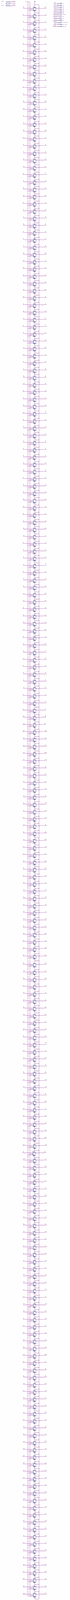
[diagram p0: schematic sheet, whole]
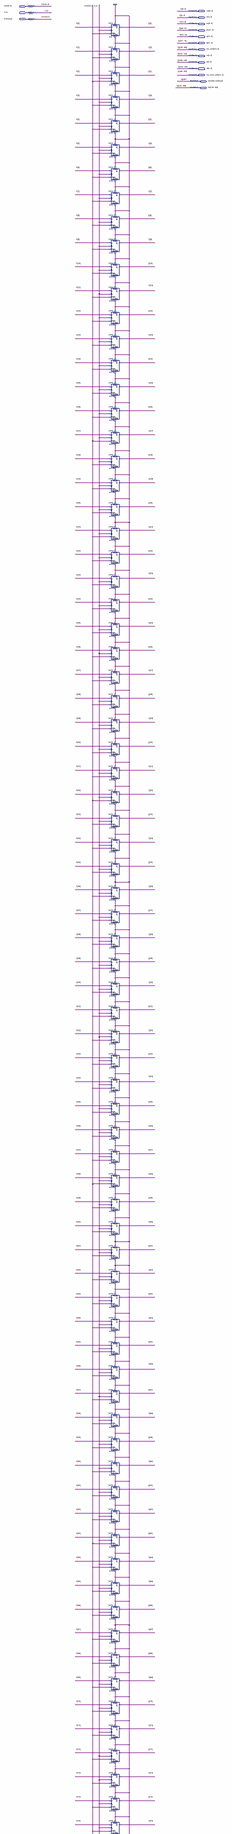
[diagram p1: schematic sheet, upper part]
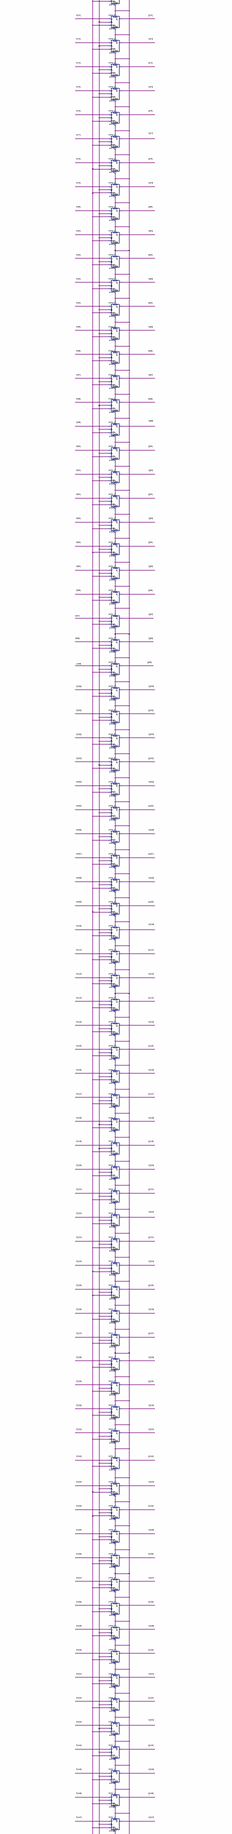
[diagram p2: schematic sheet, middle part]
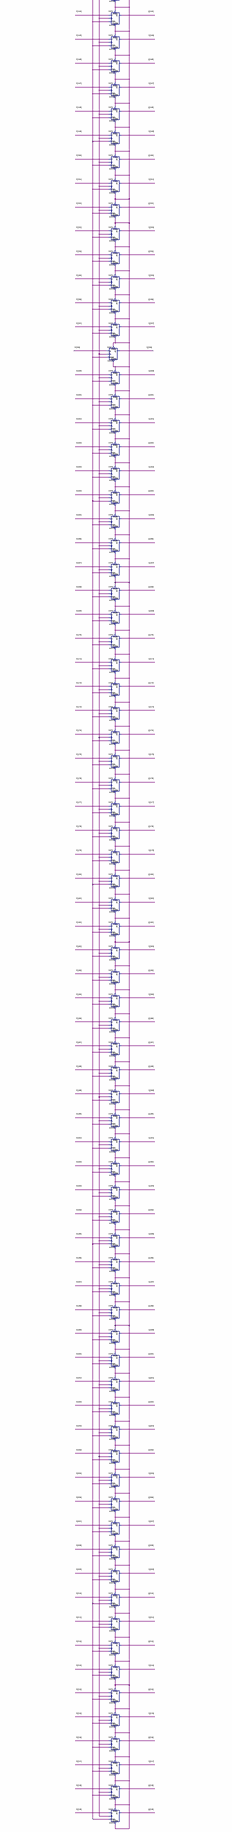
[diagram p3: schematic sheet, lower part]
// Quartus schematic REG154BIDEX.bdf as structural Verilog: 220 symbols, 16 pins
module REG154BIDEX (
  input  [219:0] D,
  input  CLK,
  input  ENABLE,
  output [2:0] wb,
  output [1:0] m,
  output [6:0] ex,
  output [31:0] pc,
  output [31:0] a,
  output [31:0] b,
  output [31:0] ext_sinal,
  output [4:0] rs,
  output [4:0] rt,
  output [4:0] rd,
  output [31:0] ext_sinal_zero,
  output escolhe_extensao,
  output [219:188] lui
);

  DFFE inst (.PRN(1'b1), .CLRN(1'b1), .D(D[0]), .CLK(CLK), .ENA(ENABLE), .Q(wb[0]));
  DFFE inst1 (.PRN(1'b1), .CLRN(1'b1), .D(D[1]), .CLK(CLK), .ENA(ENABLE), .Q(wb[1]));
  DFFE inst4 (.PRN(1'b1), .CLRN(1'b1), .D(D[2]), .CLK(CLK), .ENA(ENABLE), .Q(wb[2]));
  DFFE inst2 (.PRN(1'b1), .CLRN(1'b1), .D(D[3]), .CLK(CLK), .ENA(ENABLE), .Q(m[0]));
  DFFE inst5 (.PRN(1'b1), .CLRN(1'b1), .D(D[4]), .CLK(CLK), .ENA(ENABLE), .Q(m[1]));
  DFFE inst3 (.PRN(1'b1), .CLRN(1'b1), .D(D[5]), .CLK(CLK), .ENA(ENABLE), .Q(ex[0]));
  DFFE inst6 (.PRN(1'b1), .CLRN(1'b1), .D(D[6]), .CLK(CLK), .ENA(ENABLE), .Q(ex[1]));
  DFFE inst7 (.PRN(1'b1), .CLRN(1'b1), .D(D[7]), .CLK(CLK), .ENA(ENABLE), .Q(ex[2]));
  DFFE inst8 (.PRN(1'b1), .CLRN(1'b1), .D(D[8]), .CLK(CLK), .ENA(ENABLE), .Q(ex[3]));
  DFFE inst9 (.PRN(1'b1), .CLRN(1'b1), .D(D[9]), .CLK(CLK), .ENA(ENABLE), .Q(ex[4]));
  DFFE inst10 (.PRN(1'b1), .CLRN(1'b1), .D(D[10]), .CLK(CLK), .ENA(ENABLE), .Q(ex[5]));
  DFFE inst11 (.PRN(1'b1), .CLRN(1'b1), .D(D[11]), .CLK(CLK), .ENA(ENABLE), .Q(ex[6]));
  DFFE inst12 (.PRN(1'b1), .CLRN(1'b1), .D(D[12]), .CLK(CLK), .ENA(ENABLE), .Q(pc[0]));
  DFFE inst13 (.PRN(1'b1), .CLRN(1'b1), .D(D[13]), .CLK(CLK), .ENA(ENABLE), .Q(pc[1]));
  DFFE inst14 (.PRN(1'b1), .CLRN(1'b1), .D(D[14]), .CLK(CLK), .ENA(ENABLE), .Q(pc[2]));
  DFFE inst15 (.PRN(1'b1), .CLRN(1'b1), .D(D[15]), .CLK(CLK), .ENA(ENABLE), .Q(pc[3]));
  DFFE inst16 (.PRN(1'b1), .CLRN(1'b1), .D(D[16]), .CLK(CLK), .ENA(ENABLE), .Q(pc[4]));
  DFFE inst17 (.PRN(1'b1), .CLRN(1'b1), .D(D[17]), .CLK(CLK), .ENA(ENABLE), .Q(pc[5]));
  DFFE inst18 (.PRN(1'b1), .CLRN(1'b1), .D(D[18]), .CLK(CLK), .ENA(ENABLE), .Q(pc[6]));
  DFFE inst19 (.PRN(1'b1), .CLRN(1'b1), .D(D[19]), .CLK(CLK), .ENA(ENABLE), .Q(pc[7]));
  DFFE inst20 (.PRN(1'b1), .CLRN(1'b1), .D(D[20]), .CLK(CLK), .ENA(ENABLE), .Q(pc[8]));
  DFFE inst21 (.PRN(1'b1), .CLRN(1'b1), .D(D[21]), .CLK(CLK), .ENA(ENABLE), .Q(pc[9]));
  DFFE inst22 (.PRN(1'b1), .CLRN(1'b1), .D(D[22]), .CLK(CLK), .ENA(ENABLE), .Q(pc[10]));
  DFFE inst23 (.PRN(1'b1), .CLRN(1'b1), .D(D[23]), .CLK(CLK), .ENA(ENABLE), .Q(pc[11]));
  DFFE inst24 (.PRN(1'b1), .CLRN(1'b1), .D(D[24]), .CLK(CLK), .ENA(ENABLE), .Q(pc[12]));
  DFFE inst25 (.PRN(1'b1), .CLRN(1'b1), .D(D[25]), .CLK(CLK), .ENA(ENABLE), .Q(pc[13]));
  DFFE inst26 (.PRN(1'b1), .CLRN(1'b1), .D(D[26]), .CLK(CLK), .ENA(ENABLE), .Q(pc[14]));
  DFFE inst27 (.PRN(1'b1), .CLRN(1'b1), .D(D[27]), .CLK(CLK), .ENA(ENABLE), .Q(pc[15]));
  DFFE inst28 (.PRN(1'b1), .CLRN(1'b1), .D(D[28]), .CLK(CLK), .ENA(ENABLE), .Q(pc[16]));
  DFFE inst29 (.PRN(1'b1), .CLRN(1'b1), .D(D[29]), .CLK(CLK), .ENA(ENABLE), .Q(pc[17]));
  DFFE inst30 (.PRN(1'b1), .CLRN(1'b1), .D(D[30]), .CLK(CLK), .ENA(ENABLE), .Q(pc[18]));
  DFFE inst31 (.PRN(1'b1), .CLRN(1'b1), .D(D[31]), .CLK(CLK), .ENA(ENABLE), .Q(pc[19]));
  DFFE inst32 (.PRN(1'b1), .CLRN(1'b1), .D(D[32]), .CLK(CLK), .ENA(ENABLE), .Q(pc[20]));
  DFFE inst33 (.PRN(1'b1), .CLRN(1'b1), .D(D[33]), .CLK(CLK), .ENA(ENABLE), .Q(pc[21]));
  DFFE inst34 (.PRN(1'b1), .CLRN(1'b1), .D(D[34]), .CLK(CLK), .ENA(ENABLE), .Q(pc[22]));
  DFFE inst35 (.PRN(1'b1), .CLRN(1'b1), .D(D[35]), .CLK(CLK), .ENA(ENABLE), .Q(pc[23]));
  DFFE inst36 (.PRN(1'b1), .CLRN(1'b1), .D(D[36]), .CLK(CLK), .ENA(ENABLE), .Q(pc[24]));
  DFFE inst37 (.PRN(1'b1), .CLRN(1'b1), .D(D[37]), .CLK(CLK), .ENA(ENABLE), .Q(pc[25]));
  DFFE inst38 (.PRN(1'b1), .CLRN(1'b1), .D(D[38]), .CLK(CLK), .ENA(ENABLE), .Q(pc[26]));
  DFFE inst39 (.PRN(1'b1), .CLRN(1'b1), .D(D[39]), .CLK(CLK), .ENA(ENABLE), .Q(pc[27]));
  DFFE inst40 (.PRN(1'b1), .CLRN(1'b1), .D(D[40]), .CLK(CLK), .ENA(ENABLE), .Q(pc[28]));
  DFFE inst41 (.PRN(1'b1), .CLRN(1'b1), .D(D[41]), .CLK(CLK), .ENA(ENABLE), .Q(pc[29]));
  DFFE inst42 (.PRN(1'b1), .CLRN(1'b1), .D(D[42]), .CLK(CLK), .ENA(ENABLE), .Q(pc[30]));
  DFFE inst43 (.PRN(1'b1), .CLRN(1'b1), .D(D[43]), .CLK(CLK), .ENA(ENABLE), .Q(pc[31]));
  DFFE inst44 (.PRN(1'b1), .CLRN(1'b1), .D(D[44]), .CLK(CLK), .ENA(ENABLE), .Q(a[0]));
  DFFE inst45 (.PRN(1'b1), .CLRN(1'b1), .D(D[45]), .CLK(CLK), .ENA(ENABLE), .Q(a[1]));
  DFFE inst46 (.PRN(1'b1), .CLRN(1'b1), .D(D[46]), .CLK(CLK), .ENA(ENABLE), .Q(a[2]));
  DFFE inst47 (.PRN(1'b1), .CLRN(1'b1), .D(D[47]), .CLK(CLK), .ENA(ENABLE), .Q(a[3]));
  DFFE inst48 (.PRN(1'b1), .CLRN(1'b1), .D(D[48]), .CLK(CLK), .ENA(ENABLE), .Q(a[4]));
  DFFE inst49 (.PRN(1'b1), .CLRN(1'b1), .D(D[49]), .CLK(CLK), .ENA(ENABLE), .Q(a[5]));
  DFFE inst50 (.PRN(1'b1), .CLRN(1'b1), .D(D[50]), .CLK(CLK), .ENA(ENABLE), .Q(a[6]));
  DFFE inst51 (.PRN(1'b1), .CLRN(1'b1), .D(D[51]), .CLK(CLK), .ENA(ENABLE), .Q(a[7]));
  DFFE inst52 (.PRN(1'b1), .CLRN(1'b1), .D(D[52]), .CLK(CLK), .ENA(ENABLE), .Q(a[8]));
  DFFE inst53 (.PRN(1'b1), .CLRN(1'b1), .D(D[53]), .CLK(CLK), .ENA(ENABLE), .Q(a[9]));
  DFFE inst54 (.PRN(1'b1), .CLRN(1'b1), .D(D[54]), .CLK(CLK), .ENA(ENABLE), .Q(a[10]));
  DFFE inst55 (.PRN(1'b1), .CLRN(1'b1), .D(D[55]), .CLK(CLK), .ENA(ENABLE), .Q(a[11]));
  DFFE inst56 (.PRN(1'b1), .CLRN(1'b1), .D(D[56]), .CLK(CLK), .ENA(ENABLE), .Q(a[12]));
  DFFE inst57 (.PRN(1'b1), .CLRN(1'b1), .D(D[57]), .CLK(CLK), .ENA(ENABLE), .Q(a[13]));
  DFFE inst58 (.PRN(1'b1), .CLRN(1'b1), .D(D[58]), .CLK(CLK), .ENA(ENABLE), .Q(a[14]));
  DFFE inst59 (.PRN(1'b1), .CLRN(1'b1), .D(D[59]), .CLK(CLK), .ENA(ENABLE), .Q(a[15]));
  DFFE inst60 (.PRN(1'b1), .CLRN(1'b1), .D(D[60]), .CLK(CLK), .ENA(ENABLE), .Q(a[16]));
  DFFE inst61 (.PRN(1'b1), .CLRN(1'b1), .D(D[61]), .CLK(CLK), .ENA(ENABLE), .Q(a[17]));
  DFFE inst62 (.PRN(1'b1), .CLRN(1'b1), .D(D[62]), .CLK(CLK), .ENA(ENABLE), .Q(a[18]));
  DFFE inst63 (.PRN(1'b1), .CLRN(1'b1), .D(D[63]), .CLK(CLK), .ENA(ENABLE), .Q(a[19]));
  DFFE inst64 (.PRN(1'b1), .CLRN(1'b1), .D(D[64]), .CLK(CLK), .ENA(ENABLE), .Q(a[20]));
  DFFE inst65 (.PRN(1'b1), .CLRN(1'b1), .D(D[65]), .CLK(CLK), .ENA(ENABLE), .Q(a[21]));
  DFFE inst66 (.PRN(1'b1), .CLRN(1'b1), .D(D[66]), .CLK(CLK), .ENA(ENABLE), .Q(a[22]));
  DFFE inst67 (.PRN(1'b1), .CLRN(1'b1), .D(D[67]), .CLK(CLK), .ENA(ENABLE), .Q(a[23]));
  DFFE inst68 (.PRN(1'b1), .CLRN(1'b1), .D(D[68]), .CLK(CLK), .ENA(ENABLE), .Q(a[24]));
  DFFE inst69 (.PRN(1'b1), .CLRN(1'b1), .D(D[69]), .CLK(CLK), .ENA(ENABLE), .Q(a[25]));
  DFFE inst70 (.PRN(1'b1), .CLRN(1'b1), .D(D[70]), .CLK(CLK), .ENA(ENABLE), .Q(a[26]));
  DFFE inst71 (.PRN(1'b1), .CLRN(1'b1), .D(D[71]), .CLK(CLK), .ENA(ENABLE), .Q(a[27]));
  DFFE inst72 (.PRN(1'b1), .CLRN(1'b1), .D(D[72]), .CLK(CLK), .ENA(ENABLE), .Q(a[28]));
  DFFE inst73 (.PRN(1'b1), .CLRN(1'b1), .D(D[73]), .CLK(CLK), .ENA(ENABLE), .Q(a[29]));
  DFFE inst74 (.PRN(1'b1), .CLRN(1'b1), .D(D[74]), .CLK(CLK), .ENA(ENABLE), .Q(a[30]));
  DFFE inst75 (.PRN(1'b1), .CLRN(1'b1), .D(D[75]), .CLK(CLK), .ENA(ENABLE), .Q(a[31]));
  DFFE inst76 (.PRN(1'b1), .CLRN(1'b1), .D(D[76]), .CLK(CLK), .ENA(ENABLE), .Q(b[0]));
  DFFE inst77 (.PRN(1'b1), .CLRN(1'b1), .D(D[77]), .CLK(CLK), .ENA(ENABLE), .Q(b[1]));
  DFFE inst78 (.PRN(1'b1), .CLRN(1'b1), .D(D[78]), .CLK(CLK), .ENA(ENABLE), .Q(b[2]));
  DFFE inst79 (.PRN(1'b1), .CLRN(1'b1), .D(D[79]), .CLK(CLK), .ENA(ENABLE), .Q(b[3]));
  DFFE inst80 (.PRN(1'b1), .CLRN(1'b1), .D(D[80]), .CLK(CLK), .ENA(ENABLE), .Q(b[4]));
  DFFE inst81 (.PRN(1'b1), .CLRN(1'b1), .D(D[81]), .CLK(CLK), .ENA(ENABLE), .Q(b[5]));
  DFFE inst82 (.PRN(1'b1), .CLRN(1'b1), .D(D[82]), .CLK(CLK), .ENA(ENABLE), .Q(b[6]));
  DFFE inst83 (.PRN(1'b1), .CLRN(1'b1), .D(D[83]), .CLK(CLK), .ENA(ENABLE), .Q(b[7]));
  DFFE inst84 (.PRN(1'b1), .CLRN(1'b1), .D(D[84]), .CLK(CLK), .ENA(ENABLE), .Q(b[8]));
  DFFE inst85 (.PRN(1'b1), .CLRN(1'b1), .D(D[85]), .CLK(CLK), .ENA(ENABLE), .Q(b[9]));
  DFFE inst86 (.PRN(1'b1), .CLRN(1'b1), .D(D[86]), .CLK(CLK), .ENA(ENABLE), .Q(b[10]));
  DFFE inst87 (.PRN(1'b1), .CLRN(1'b1), .D(D[87]), .CLK(CLK), .ENA(ENABLE), .Q(b[11]));
  DFFE inst88 (.PRN(1'b1), .CLRN(1'b1), .D(D[88]), .CLK(CLK), .ENA(ENABLE), .Q(b[12]));
  DFFE inst89 (.PRN(1'b1), .CLRN(1'b1), .D(D[89]), .CLK(CLK), .ENA(ENABLE), .Q(b[13]));
  DFFE inst90 (.PRN(1'b1), .CLRN(1'b1), .D(D[90]), .CLK(CLK), .ENA(ENABLE), .Q(b[14]));
  DFFE inst91 (.PRN(1'b1), .CLRN(1'b1), .D(D[91]), .CLK(CLK), .ENA(ENABLE), .Q(b[15]));
  DFFE inst92 (.PRN(1'b1), .CLRN(1'b1), .D(D[92]), .CLK(CLK), .ENA(ENABLE), .Q(b[16]));
  DFFE inst93 (.PRN(1'b1), .CLRN(1'b1), .D(D[93]), .CLK(CLK), .ENA(ENABLE), .Q(b[17]));
  DFFE inst94 (.PRN(1'b1), .CLRN(1'b1), .D(D[94]), .CLK(CLK), .ENA(ENABLE), .Q(b[18]));
  DFFE inst95 (.PRN(1'b1), .CLRN(1'b1), .D(D[95]), .CLK(CLK), .ENA(ENABLE), .Q(b[19]));
  DFFE inst96 (.PRN(1'b1), .CLRN(1'b1), .D(D[96]), .CLK(CLK), .ENA(ENABLE), .Q(b[20]));
  DFFE inst99 (.PRN(1'b1), .CLRN(1'b1), .D(D[97]), .CLK(CLK), .ENA(ENABLE), .Q(b[21]));
  DFFE inst132 (.PRN(1'b1), .CLRN(1'b1), .D(D[98]), .CLK(CLK), .ENA(ENABLE), .Q(b[22]));
  DFFE inst133 (.PRN(1'b1), .CLRN(1'b1), .D(D[99]), .CLK(CLK), .ENA(ENABLE), .Q(b[23]));
  DFFE inst100 (.PRN(1'b1), .CLRN(1'b1), .D(D[100]), .CLK(CLK), .ENA(ENABLE), .Q(b[24]));
  DFFE inst101 (.PRN(1'b1), .CLRN(1'b1), .D(D[101]), .CLK(CLK), .ENA(ENABLE), .Q(b[25]));
  DFFE inst102 (.PRN(1'b1), .CLRN(1'b1), .D(D[102]), .CLK(CLK), .ENA(ENABLE), .Q(b[26]));
  DFFE inst103 (.PRN(1'b1), .CLRN(1'b1), .D(D[103]), .CLK(CLK), .ENA(ENABLE), .Q(b[27]));
  DFFE inst104 (.PRN(1'b1), .CLRN(1'b1), .D(D[104]), .CLK(CLK), .ENA(ENABLE), .Q(b[28]));
  DFFE inst105 (.PRN(1'b1), .CLRN(1'b1), .D(D[105]), .CLK(CLK), .ENA(ENABLE), .Q(b[29]));
  DFFE inst106 (.PRN(1'b1), .CLRN(1'b1), .D(D[106]), .CLK(CLK), .ENA(ENABLE), .Q(b[30]));
  DFFE inst107 (.PRN(1'b1), .CLRN(1'b1), .D(D[107]), .CLK(CLK), .ENA(ENABLE), .Q(b[31]));
  DFFE inst108 (.PRN(1'b1), .CLRN(1'b1), .D(D[108]), .CLK(CLK), .ENA(ENABLE), .Q(ext_sinal[0]));
  DFFE inst109 (.PRN(1'b1), .CLRN(1'b1), .D(D[109]), .CLK(CLK), .ENA(ENABLE), .Q(ext_sinal[1]));
  DFFE inst110 (.PRN(1'b1), .CLRN(1'b1), .D(D[110]), .CLK(CLK), .ENA(ENABLE), .Q(ext_sinal[2]));
  DFFE inst111 (.PRN(1'b1), .CLRN(1'b1), .D(D[111]), .CLK(CLK), .ENA(ENABLE), .Q(ext_sinal[3]));
  DFFE inst112 (.PRN(1'b1), .CLRN(1'b1), .D(D[112]), .CLK(CLK), .ENA(ENABLE), .Q(ext_sinal[4]));
  DFFE inst113 (.PRN(1'b1), .CLRN(1'b1), .D(D[113]), .CLK(CLK), .ENA(ENABLE), .Q(ext_sinal[5]));
  DFFE inst114 (.PRN(1'b1), .CLRN(1'b1), .D(D[114]), .CLK(CLK), .ENA(ENABLE), .Q(ext_sinal[6]));
  DFFE inst115 (.PRN(1'b1), .CLRN(1'b1), .D(D[115]), .CLK(CLK), .ENA(ENABLE), .Q(ext_sinal[7]));
  DFFE inst116 (.PRN(1'b1), .CLRN(1'b1), .D(D[116]), .CLK(CLK), .ENA(ENABLE), .Q(ext_sinal[8]));
  DFFE inst117 (.PRN(1'b1), .CLRN(1'b1), .D(D[117]), .CLK(CLK), .ENA(ENABLE), .Q(ext_sinal[9]));
  DFFE inst118 (.PRN(1'b1), .CLRN(1'b1), .D(D[118]), .CLK(CLK), .ENA(ENABLE), .Q(ext_sinal[10]));
  DFFE inst119 (.PRN(1'b1), .CLRN(1'b1), .D(D[119]), .CLK(CLK), .ENA(ENABLE), .Q(ext_sinal[11]));
  DFFE inst120 (.PRN(1'b1), .CLRN(1'b1), .D(D[120]), .CLK(CLK), .ENA(ENABLE), .Q(ext_sinal[12]));
  DFFE inst121 (.PRN(1'b1), .CLRN(1'b1), .D(D[121]), .CLK(CLK), .ENA(ENABLE), .Q(ext_sinal[13]));
  DFFE inst122 (.PRN(1'b1), .CLRN(1'b1), .D(D[122]), .CLK(CLK), .ENA(ENABLE), .Q(ext_sinal[14]));
  DFFE inst123 (.PRN(1'b1), .CLRN(1'b1), .D(D[123]), .CLK(CLK), .ENA(ENABLE), .Q(ext_sinal[15]));
  DFFE inst124 (.PRN(1'b1), .CLRN(1'b1), .D(D[124]), .CLK(CLK), .ENA(ENABLE), .Q(ext_sinal[16]));
  DFFE inst125 (.PRN(1'b1), .CLRN(1'b1), .D(D[125]), .CLK(CLK), .ENA(ENABLE), .Q(ext_sinal[17]));
  DFFE inst126 (.PRN(1'b1), .CLRN(1'b1), .D(D[126]), .CLK(CLK), .ENA(ENABLE), .Q(ext_sinal[18]));
  DFFE inst127 (.PRN(1'b1), .CLRN(1'b1), .D(D[127]), .CLK(CLK), .ENA(ENABLE), .Q(ext_sinal[19]));
  DFFE inst128 (.PRN(1'b1), .CLRN(1'b1), .D(D[128]), .CLK(CLK), .ENA(ENABLE), .Q(ext_sinal[20]));
  DFFE inst129 (.PRN(1'b1), .CLRN(1'b1), .D(D[129]), .CLK(CLK), .ENA(ENABLE), .Q(ext_sinal[21]));
  DFFE inst130 (.PRN(1'b1), .CLRN(1'b1), .D(D[130]), .CLK(CLK), .ENA(ENABLE), .Q(ext_sinal[22]));
  DFFE inst131 (.PRN(1'b1), .CLRN(1'b1), .D(D[131]), .CLK(CLK), .ENA(ENABLE), .Q(ext_sinal[23]));
  DFFE inst97 (.PRN(1'b1), .CLRN(1'b1), .D(D[132]), .CLK(CLK), .ENA(ENABLE), .Q(ext_sinal[24]));
  DFFE inst134 (.PRN(1'b1), .CLRN(1'b1), .D(D[133]), .CLK(CLK), .ENA(ENABLE), .Q(ext_sinal[25]));
  DFFE inst135 (.PRN(1'b1), .CLRN(1'b1), .D(D[134]), .CLK(CLK), .ENA(ENABLE), .Q(ext_sinal[26]));
  DFFE inst136 (.PRN(1'b1), .CLRN(1'b1), .D(D[135]), .CLK(CLK), .ENA(ENABLE), .Q(ext_sinal[27]));
  DFFE inst137 (.PRN(1'b1), .CLRN(1'b1), .D(D[136]), .CLK(CLK), .ENA(ENABLE), .Q(ext_sinal[28]));
  DFFE inst138 (.PRN(1'b1), .CLRN(1'b1), .D(D[137]), .CLK(CLK), .ENA(ENABLE), .Q(ext_sinal[29]));
  DFFE inst139 (.PRN(1'b1), .CLRN(1'b1), .D(D[138]), .CLK(CLK), .ENA(ENABLE), .Q(ext_sinal[30]));
  DFFE inst140 (.PRN(1'b1), .CLRN(1'b1), .D(D[139]), .CLK(CLK), .ENA(ENABLE), .Q(ext_sinal[31]));
  DFFE inst141 (.PRN(1'b1), .CLRN(1'b1), .D(D[140]), .CLK(CLK), .ENA(ENABLE), .Q(rs[0]));
  DFFE inst142 (.PRN(1'b1), .CLRN(1'b1), .D(D[141]), .CLK(CLK), .ENA(ENABLE), .Q(rs[1]));
  DFFE inst143 (.PRN(1'b1), .CLRN(1'b1), .D(D[142]), .CLK(CLK), .ENA(ENABLE), .Q(rs[2]));
  DFFE inst144 (.PRN(1'b1), .CLRN(1'b1), .D(D[143]), .CLK(CLK), .ENA(ENABLE), .Q(rs[3]));
  DFFE inst145 (.PRN(1'b1), .CLRN(1'b1), .D(D[144]), .CLK(CLK), .ENA(ENABLE), .Q(rs[4]));
  DFFE inst146 (.PRN(1'b1), .CLRN(1'b1), .D(D[145]), .CLK(CLK), .ENA(ENABLE), .Q(rt[0]));
  DFFE inst147 (.PRN(1'b1), .CLRN(1'b1), .D(D[146]), .CLK(CLK), .ENA(ENABLE), .Q(rt[1]));
  DFFE inst148 (.PRN(1'b1), .CLRN(1'b1), .D(D[147]), .CLK(CLK), .ENA(ENABLE), .Q(rt[2]));
  DFFE inst149 (.PRN(1'b1), .CLRN(1'b1), .D(D[148]), .CLK(CLK), .ENA(ENABLE), .Q(rt[3]));
  DFFE inst150 (.PRN(1'b1), .CLRN(1'b1), .D(D[149]), .CLK(CLK), .ENA(ENABLE), .Q(rt[4]));
  DFFE inst151 (.PRN(1'b1), .CLRN(1'b1), .D(D[150]), .CLK(CLK), .ENA(ENABLE), .Q(rd[0]));
  DFFE inst156 (.PRN(1'b1), .CLRN(1'b1), .D(D[151]), .CLK(CLK), .ENA(ENABLE), .Q(rd[1]));
  DFFE inst157 (.PRN(1'b1), .CLRN(1'b1), .D(D[152]), .CLK(CLK), .ENA(ENABLE), .Q(rd[2]));
  DFFE inst158 (.PRN(1'b1), .CLRN(1'b1), .D(D[153]), .CLK(CLK), .ENA(ENABLE), .Q(rd[3]));
  DFFE inst159 (.PRN(1'b1), .CLRN(1'b1), .D(D[154]), .CLK(CLK), .ENA(ENABLE), .Q(rd[4]));
  DFFE inst160 (.PRN(1'b1), .CLRN(1'b1), .D(D[155]), .CLK(CLK), .ENA(ENABLE), .Q(ext_sinal_zero[0]));
  DFFE inst161 (.PRN(1'b1), .CLRN(1'b1), .D(D[156]), .CLK(CLK), .ENA(ENABLE), .Q(ext_sinal_zero[1]));
  DFFE inst162 (.PRN(1'b1), .CLRN(1'b1), .D(D[157]), .CLK(CLK), .ENA(ENABLE), .Q(ext_sinal_zero[2]));
  DFFE inst163 (.PRN(1'b1), .CLRN(1'b1), .D(D[158]), .CLK(CLK), .ENA(ENABLE), .Q(ext_sinal_zero[3]));
  DFFE inst164 (.PRN(1'b1), .CLRN(1'b1), .D(D[159]), .CLK(CLK), .ENA(ENABLE), .Q(ext_sinal_zero[4]));
  DFFE inst165 (.PRN(1'b1), .CLRN(1'b1), .D(D[160]), .CLK(CLK), .ENA(ENABLE), .Q(ext_sinal_zero[5]));
  DFFE inst166 (.PRN(1'b1), .CLRN(1'b1), .D(D[161]), .CLK(CLK), .ENA(ENABLE), .Q(ext_sinal_zero[6]));
  DFFE inst167 (.PRN(1'b1), .CLRN(1'b1), .D(D[162]), .CLK(CLK), .ENA(ENABLE), .Q(ext_sinal_zero[7]));
  DFFE inst168 (.PRN(1'b1), .CLRN(1'b1), .D(D[163]), .CLK(CLK), .ENA(ENABLE), .Q(ext_sinal_zero[8]));
  DFFE inst169 (.PRN(1'b1), .CLRN(1'b1), .D(D[164]), .CLK(CLK), .ENA(ENABLE), .Q(ext_sinal_zero[9]));
  DFFE inst170 (.PRN(1'b1), .CLRN(1'b1), .D(D[165]), .CLK(CLK), .ENA(ENABLE), .Q(ext_sinal_zero[10]));
  DFFE inst171 (.PRN(1'b1), .CLRN(1'b1), .D(D[166]), .CLK(CLK), .ENA(ENABLE), .Q(ext_sinal_zero[11]));
  DFFE inst172 (.PRN(1'b1), .CLRN(1'b1), .D(D[167]), .CLK(CLK), .ENA(ENABLE), .Q(ext_sinal_zero[12]));
  DFFE inst173 (.PRN(1'b1), .CLRN(1'b1), .D(D[168]), .CLK(CLK), .ENA(ENABLE), .Q(ext_sinal_zero[13]));
  DFFE inst174 (.PRN(1'b1), .CLRN(1'b1), .D(D[169]), .CLK(CLK), .ENA(ENABLE), .Q(ext_sinal_zero[14]));
  DFFE inst175 (.PRN(1'b1), .CLRN(1'b1), .D(D[170]), .CLK(CLK), .ENA(ENABLE), .Q(ext_sinal_zero[15]));
  DFFE inst176 (.PRN(1'b1), .CLRN(1'b1), .D(D[171]), .CLK(CLK), .ENA(ENABLE), .Q(ext_sinal_zero[16]));
  DFFE inst177 (.PRN(1'b1), .CLRN(1'b1), .D(D[172]), .CLK(CLK), .ENA(ENABLE), .Q(ext_sinal_zero[17]));
  DFFE inst178 (.PRN(1'b1), .CLRN(1'b1), .D(D[173]), .CLK(CLK), .ENA(ENABLE), .Q(ext_sinal_zero[18]));
  DFFE inst179 (.PRN(1'b1), .CLRN(1'b1), .D(D[174]), .CLK(CLK), .ENA(ENABLE), .Q(ext_sinal_zero[19]));
  DFFE inst180 (.PRN(1'b1), .CLRN(1'b1), .D(D[175]), .CLK(CLK), .ENA(ENABLE), .Q(ext_sinal_zero[20]));
  DFFE inst181 (.PRN(1'b1), .CLRN(1'b1), .D(D[176]), .CLK(CLK), .ENA(ENABLE), .Q(ext_sinal_zero[21]));
  DFFE inst182 (.PRN(1'b1), .CLRN(1'b1), .D(D[177]), .CLK(CLK), .ENA(ENABLE), .Q(ext_sinal_zero[22]));
  DFFE inst183 (.PRN(1'b1), .CLRN(1'b1), .D(D[178]), .CLK(CLK), .ENA(ENABLE), .Q(ext_sinal_zero[23]));
  DFFE inst184 (.PRN(1'b1), .CLRN(1'b1), .D(D[179]), .CLK(CLK), .ENA(ENABLE), .Q(ext_sinal_zero[24]));
  DFFE inst185 (.PRN(1'b1), .CLRN(1'b1), .D(D[180]), .CLK(CLK), .ENA(ENABLE), .Q(ext_sinal_zero[25]));
  DFFE inst186 (.PRN(1'b1), .CLRN(1'b1), .D(D[181]), .CLK(CLK), .ENA(ENABLE), .Q(ext_sinal_zero[26]));
  DFFE inst187 (.PRN(1'b1), .CLRN(1'b1), .D(D[182]), .CLK(CLK), .ENA(ENABLE), .Q(ext_sinal_zero[27]));
  DFFE inst188 (.PRN(1'b1), .CLRN(1'b1), .D(D[183]), .CLK(CLK), .ENA(ENABLE), .Q(ext_sinal_zero[28]));
  DFFE inst189 (.PRN(1'b1), .CLRN(1'b1), .D(D[184]), .CLK(CLK), .ENA(ENABLE), .Q(ext_sinal_zero[29]));
  DFFE inst190 (.PRN(1'b1), .CLRN(1'b1), .D(D[185]), .CLK(CLK), .ENA(ENABLE), .Q(ext_sinal_zero[30]));
  DFFE inst191 (.PRN(1'b1), .CLRN(1'b1), .D(D[186]), .CLK(CLK), .ENA(ENABLE), .Q(ext_sinal_zero[31]));
  DFFE inst192 (.PRN(1'b1), .CLRN(1'b1), .D(D[187]), .CLK(CLK), .ENA(ENABLE), .Q(escolhe_extensao));
  DFFE inst193 (.PRN(1'b1), .CLRN(1'b1), .D(D[188]), .CLK(CLK), .ENA(ENABLE), .Q(lui[188]));
  DFFE inst194 (.PRN(1'b1), .CLRN(1'b1), .D(D[189]), .CLK(CLK), .ENA(ENABLE), .Q(lui[189]));
  DFFE inst195 (.PRN(1'b1), .CLRN(1'b1), .D(D[190]), .CLK(CLK), .ENA(ENABLE), .Q(lui[190]));
  DFFE inst196 (.PRN(1'b1), .CLRN(1'b1), .D(D[191]), .CLK(CLK), .ENA(ENABLE), .Q(lui[191]));
  DFFE inst197 (.PRN(1'b1), .CLRN(1'b1), .D(D[192]), .CLK(CLK), .ENA(ENABLE), .Q(lui[192]));
  DFFE inst198 (.PRN(1'b1), .CLRN(1'b1), .D(D[193]), .CLK(CLK), .ENA(ENABLE), .Q(lui[193]));
  DFFE inst199 (.PRN(1'b1), .CLRN(1'b1), .D(D[194]), .CLK(CLK), .ENA(ENABLE), .Q(lui[194]));
  DFFE inst200 (.PRN(1'b1), .CLRN(1'b1), .D(D[195]), .CLK(CLK), .ENA(ENABLE), .Q(lui[195]));
  DFFE inst201 (.PRN(1'b1), .CLRN(1'b1), .D(D[196]), .CLK(CLK), .ENA(ENABLE), .Q(lui[196]));
  DFFE inst202 (.PRN(1'b1), .CLRN(1'b1), .D(D[197]), .CLK(CLK), .ENA(ENABLE), .Q(lui[197]));
  DFFE inst203 (.PRN(1'b1), .CLRN(1'b1), .D(D[198]), .CLK(CLK), .ENA(ENABLE), .Q(lui[198]));
  DFFE inst204 (.PRN(1'b1), .CLRN(1'b1), .D(D[199]), .CLK(CLK), .ENA(ENABLE), .Q(lui[199]));
  DFFE inst205 (.PRN(1'b1), .CLRN(1'b1), .D(D[200]), .CLK(CLK), .ENA(ENABLE), .Q(lui[200]));
  DFFE inst206 (.PRN(1'b1), .CLRN(1'b1), .D(D[201]), .CLK(CLK), .ENA(ENABLE), .Q(lui[201]));
  DFFE inst207 (.PRN(1'b1), .CLRN(1'b1), .D(D[202]), .CLK(CLK), .ENA(ENABLE), .Q(lui[202]));
  DFFE inst208 (.PRN(1'b1), .CLRN(1'b1), .D(D[203]), .CLK(CLK), .ENA(ENABLE), .Q(lui[203]));
  DFFE inst209 (.PRN(1'b1), .CLRN(1'b1), .D(D[204]), .CLK(CLK), .ENA(ENABLE), .Q(lui[204]));
  DFFE inst210 (.PRN(1'b1), .CLRN(1'b1), .D(D[205]), .CLK(CLK), .ENA(ENABLE), .Q(lui[205]));
  DFFE inst211 (.PRN(1'b1), .CLRN(1'b1), .D(D[206]), .CLK(CLK), .ENA(ENABLE), .Q(lui[206]));
  DFFE inst212 (.PRN(1'b1), .CLRN(1'b1), .D(D[207]), .CLK(CLK), .ENA(ENABLE), .Q(lui[207]));
  DFFE inst213 (.PRN(1'b1), .CLRN(1'b1), .D(D[208]), .CLK(CLK), .ENA(ENABLE), .Q(lui[208]));
  DFFE inst214 (.PRN(1'b1), .CLRN(1'b1), .D(D[209]), .CLK(CLK), .ENA(ENABLE), .Q(lui[209]));
  DFFE inst215 (.PRN(1'b1), .CLRN(1'b1), .D(D[210]), .CLK(CLK), .ENA(ENABLE), .Q(lui[210]));
  DFFE inst216 (.PRN(1'b1), .CLRN(1'b1), .D(D[211]), .CLK(CLK), .ENA(ENABLE), .Q(lui[211]));
  DFFE inst217 (.PRN(1'b1), .CLRN(1'b1), .D(D[212]), .CLK(CLK), .ENA(ENABLE), .Q(lui[212]));
  DFFE inst218 (.PRN(1'b1), .CLRN(1'b1), .D(D[213]), .CLK(CLK), .ENA(ENABLE), .Q(lui[213]));
  DFFE inst219 (.PRN(1'b1), .CLRN(1'b1), .D(D[214]), .CLK(CLK), .ENA(ENABLE), .Q(lui[214]));
  DFFE inst220 (.PRN(1'b1), .CLRN(1'b1), .D(D[215]), .CLK(CLK), .ENA(ENABLE), .Q(lui[215]));
  DFFE inst221 (.PRN(1'b1), .CLRN(1'b1), .D(D[216]), .CLK(CLK), .ENA(ENABLE), .Q(lui[216]));
  DFFE inst222 (.PRN(1'b1), .CLRN(1'b1), .D(D[217]), .CLK(CLK), .ENA(ENABLE), .Q(lui[217]));
  DFFE inst223 (.PRN(1'b1), .CLRN(1'b1), .D(D[218]), .CLK(CLK), .ENA(ENABLE), .Q(lui[218]));
  DFFE inst224 (.PRN(1'b1), .CLRN(1'b1), .D(D[219]), .CLK(CLK), .ENA(ENABLE), .Q(lui[219]));

  // Other names for the same wires on the sheet: Q[219:0] = {lui, escolhe_extensao, ext_sinal_zero, rd, rt, rs, ext_sinal, b, a, pc, ex, m, wb}
endmodule
